# EasyEDA Pro project board-v3-rev1-schematic.epro

# Board PCB2
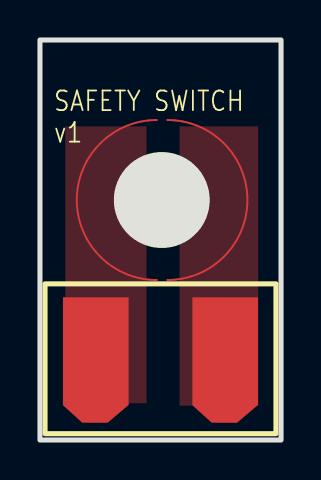
[diagram p0: board, top side]
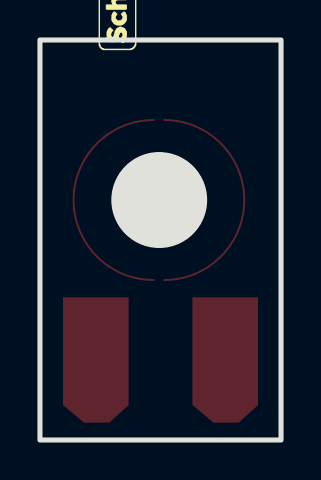
[diagram p1: board, bottom side, seen from below]

Outline 12.06 x 20 mm; copper layers: Top Layer, Bottom Layer. Coordinates in mm from the lower left corner of the outline.
Outline path: rectangle 0,20 12.06,0
Stack: Top Layer 0.035mm / Dielectric1 1.51mm FR4 er 4.5 / Bottom Layer 0.035mm

## Design rules (mm)
template: JLCPCB Capability(Two Layers Board)
spacing copperThickness1oz (default): track to track 0.102, other pairs 0.152 to 0.3
spacing copperThickness2oz: track to track 0.203, other pairs 0.152 to 0.3
track width copperThickness1oz (default): min 0.127, default 0.254, max 2.54
track width copperThickness2oz: min 0.203, default 0.254, max 2.54
differential pair differentialPair (default): width min 0.127, default 0.254, max 2.54; gap min 0.152, default 0.152
via viaSize (default): diameter min 0.5, default 0.61, max 10; hole min 0.3, default 0.305, max 6.3

## Placement (name value [footprint] x y rotation side)
U1  -  [Battery Solder Pad]  6.1 0.82 0 top
U2  -  [screw_switch]  6.1 12 0 top

## Footprints (pads in the part's own frame, mm; a bottom-side part is the same pattern mirrored in y, then rotated)
Battery Solder Pad
  custom 3.286x6.269 smd: 1(-3.302,3.175) 2(3.175,3.175)
screw_switch
  custom 4x8 smd: 1(-2.254,0) 2(2.286,0)

## Nets
$1N152: U1.1 U2.1
$1N166: U1.2 U2.2

## Copper pours and planes (outline as drawn; the poured copper is in the pictures)
$1N152 on Top Layer: 1.27,15.68 5.33,15.68 5.33,1.84 1.27,1.84
$1N166 on Top Layer: 6.99,15.68 10.92,15.68 10.92,1.71 6.99,1.71

## Text on the board
Top Silkscreen Layer: SAFETY SWITCH / v1

# Board PCB1_1
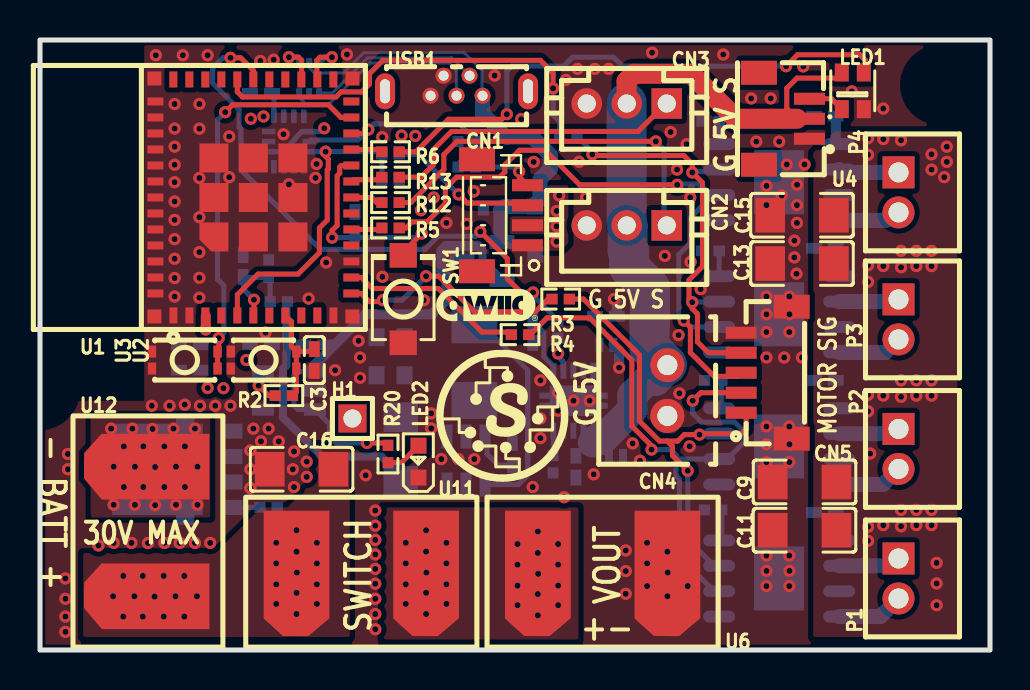
[diagram p2: board, top side]
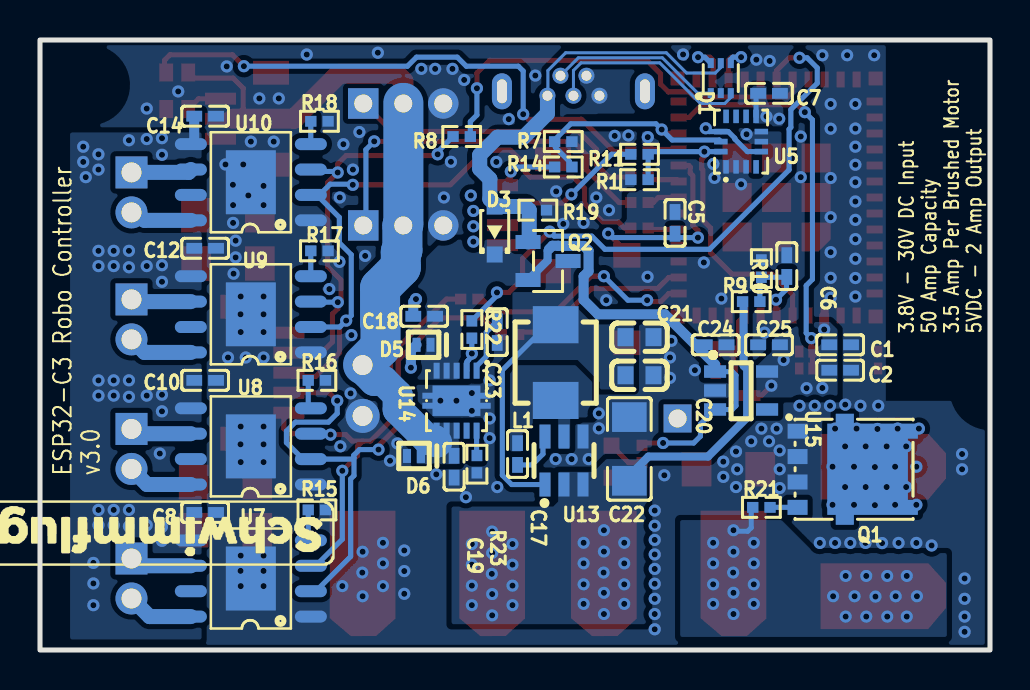
[diagram p3: board, bottom side, seen from below]

Outline 47.5 x 30.5 mm; copper layers: Top Layer, Inner1, Inner2, Bottom Layer. Coordinates in mm from the lower left corner of the outline.
Outline path: rectangle 0,30.5 47.5,0
Stack: Top Layer 0.035mm Outer layer thickness 1oz / Dielectric1 0.2104mm 7628 RC49% 8.6mil / Inner1 0.0152mm Inner layer thickness / Dielectric2 1.065mm 1.1mm H/HOZ Copper / Inner2 0.0152mm Inner layer thickness / Dielectric3 0.2104mm 7628 RC49% 8.6mil / Bottom Layer 0.035mm Outer layer thickness 1oz

## Design rules (mm)
template: Custom Config
spacing copperThickness1oz (default): track to track 0.102, other pairs 0.152 to 0.3
spacing copperThickness2oz: track to track 0.203, other pairs 0.152 to 0.3
track width copperThickness1oz (default): min 0.127, default 0.254, max 2.54
track width copperThickness2oz: min 0.203, default 0.254, max 2.54
differential pair differentialPair (default): width min 0.127, default 0.254, max 2.54; gap min 0.152, default 0.152
via viaSize (default): diameter min 0.5, default 0.61, max 10; hole min 0.3, default 0.305, max 6.3
net 3V3 uses copperRegionDirect
net GND uses copperRegionDirect
net V_IN uses copperRegionDirect
net BATT_IN uses copperRegionDirect
net BATT_GND uses copperRegionDirect
net 5V0 uses copperRegionDirect
net 5V0_FUSED uses copperRegionDirect
net 5V0_BUCK uses copperRegionDirect
net $5N11099 uses copperRegionDirect

## Placement (name value [footprint] x y rotation side)
C1  10uF  [C0402]  7.49 15.26 0 bottom
C2  100nF  [C0402]  7.49 13.99 0 bottom
C3  1uF  [C0402]  13.72 14.5 90 top
C5  1uF  [C0402]  15.75 21.36 270 bottom
C6  47nF  [C0402]  10.16 19.2 270 bottom
C7  100nF  [C0402]  11.05 27.83 0 bottom
C8  100nF  [C0402]  39.24 6.88 0 bottom
C9  10uF  [C1206]  38.23 8.4 0 top
C10  100nF  [C0402]  39.24 13.48 0 bottom
C11  10uF  [C1206]  38.23 5.99 0 top
C12  100nF  [C0402]  39.24 20.09 0 bottom
C13  10uF  [C1206]  38.1 19.32 0 top
C14  100nF  [C0402]  39.24 26.69 0 bottom
C15  10uF  [C1206]  38.1 21.74 0 top
C16  10uF  [C1206]  13.08 9.04 0 top
C17  100nF  [C0402]  23.62 9.8 270 bottom
C18  100nF  [C0402]  28.29 16.69 180 bottom
C19  1uF  [C0402]  26.8 9.16 90 bottom
C20  22uF  [C0603]  17.53 13.74 0 bottom
C21  22uF  [C0603]  17.53 15.64 0 bottom
C22  10uF  [C1206]  18.03 10.05 270 bottom
C23  1nF  [C0402]  24.64 15.89 90 bottom
C24  1uF  [C0402]  13.72 15.26 0 bottom
C25  1uF  [C0402]  11.05 15.26 180 bottom
CN1  BM04B-SRSS-TB(LF)(SN)  [CONN-SMD_BM04B-SRSS-TB]  23.11 21.74 90 top
CN2  SERVO1  [CONN-TH_3P-P2.00_BX-PH2.0-3PZZ]  29.34 21.23 180 top
CN3  SERVO2  [CONN-TH_3P-P2.00_BX-PH2.0-3PZZ]  29.34 27.33 180 top
CN4  B2B-XH-A(LF)(SN)  [CONN-TH_B2B-XH-A-LF-SN]  31.37 12.97 90 top
CN5  WAFER-SH1.0-5PLB  [CONN-SMD-5P-P1.00_BM05B-SRSS-TB-LF-SN]  36.32 13.86 90 top
D1  USBLC6-2P6_C2827693  [SOT-666-6_L1.6-W1.2-P0.50-LS1.6-BL]  13.46 28.59 180 bottom
D3  PMEG1020EA,115  [SOD-323_L1.7-W1.3-LS2.5-RD]  24.76 20.97 90 bottom
D5  RB161QS-40T18R  [X2-DFN1006-2_L1.0-W0.6-P0.65-RD]  28.32 15.26 0 bottom
D6  RB161QS-40T18R  [X2-DFN1006-2_L1.0-W0.6-P0.65-RD]  28.8 9.7 0 bottom
H1  -  [HDR-TH_1P-V-M_XKB_X4611WV-01I-C28D40]  15.62 11.58 0 top
L1  4.7uH  [IND-SMD_L4.5-W4.1_IHLP]  21.72 14.37 90 bottom
LED1  WS2812C-2020-V1  [LED-SMD_4P-L2.0-W2.0-TL_WS2812B-2020]  40.64 27.96 90 top
LED2  KT-0603R  [LED0603-RD]  18.92 9.42 90 top
P1  MOTOR1A  [CONN-TH_2P-P2.00_PH-2A_C2319]  42.93 3.58 90 top
P2  MOTOR1B  [CONN-TH_2P-P2.00_PH-2A_C2319]  42.93 10.05 90 top
P3  MOTOR2A  [CONN-TH_2P-P2.00_PH-2A_C2319]  42.93 16.53 90 top
P4  MOTOR2B  [CONN-TH_2P-P2.00_PH-2A_C2319]  42.93 22.88 90 top
Q1  NTMFS5C612NLT1G  [DFN-5_L6.1-W5.1-P1.27-BL]  7.75 9.04 270 bottom
Q2  DMG2305UX-7  [SOT-23-3_L2.9-W1.3-P1.90-LS2.4-BR]  22.1 19.45 0 bottom
R1  10kΩ  [R0402]  17.53 23.52 0 bottom
R2  10kΩ  [R0402]  12.19 12.72 180 top
R3  220Ω  [R0402]  26.03 17.55 180 top
R4  220Ω  [R0402]  24 15.77 180 top
R5  220Ω  [R0402]  17.53 21.1 180 top
R6  220Ω  [R0402]  17.53 24.91 180 top
R7  10kΩ  [R0402]  21.34 25.42 0 bottom
R8  220Ω  [R0402]  26.42 25.67 0 bottom
R9  27kΩ  [R0402]  11.94 17.42 0 bottom
R10  3kΩ  [R0402]  11.43 19.07 270 bottom
R11  100Ω  [R0402]  17.53 24.78 0 bottom
R12  220Ω  [R0402]  17.53 22.37 0 top
R13  220Ω  [R0402]  17.53 23.64 0 top
R14  100Ω  [R0402]  21.34 24.15 0 bottom
R15  18kΩ  [R0402]  33.66 7 0 bottom
R16  18kΩ  [R0402]  33.66 13.48 0 bottom
R17  18kΩ  [R0402]  33.53 19.96 0 bottom
R18  18kΩ  [R0402]  33.53 26.44 0 bottom
R19  10kΩ  [R0402]  22.61 21.99 0 bottom
R20  5.1kΩ  [R0402]  17.4 9.8 90 top
R21  10kΩ  [R0402]  11.43 7.13 0 bottom
R22  220Ω  [R0402]  25.91 16.02 270 bottom
R23  43kΩ  [R0402]  25.65 9.29 270 bottom
SW1  TS-1088-AR02016  [SW-SMD_L3.9-W3.0-P4.45]  18.16 17.55 90 top
U1  2.4GHz  [WIFIM-SMD_ESP32-C3-MINI-1]  10.67 22.63 90 top
U2  RESET  [SW-SMD_4P-L3.0-W2.0-P0.85-LS3.5]  11.18 14.5 180 top
U3  BOOT  [SW-SMD_4P-L3.0-W2.0-P0.85-LS3.5]  7.24 14.5 180 top
U4  LED  [CONN-SMD-3P-P1.00_BM03B-SRSS-TB-LF-SN]  37.21 26.56 270 top
U5  LSM6DS3TR-C  [LGA-14_L3.0-W2.5-P0.50-TL]  12.45 25.42 90 bottom
U6  -  [Battery Solder Pad]  28.19 0.66 0 top
U7  DRV8871DDAR  [SO-8_L4.9-W3.9-P1.27-LS6.0-BL-EP]  36.96 3.58 90 bottom
U8  DRV8871DDAR  [SO-8_L4.9-W3.9-P1.27-LS6.0-BL-EP]  36.96 10.18 90 bottom
U9  DRV8871DDAR  [SO-8_L4.9-W3.9-P1.27-LS6.0-BL-EP]  36.96 16.78 90 bottom
U10  DRV8871DDAR  [SO-8_L4.9-W3.9-P1.27-LS6.0-BL-EP]  36.96 23.39 90 bottom
U11  -  [Battery Solder Pad]  16.13 0.66 0 top
U12  -  [Battery Solder Pad]  2.16 5.86 270 top
U13  AP63205WU-7  [TSOT-23-6_L2.9-W1.6-P0.95-LS2.8-BL]  21.3 9.47 180 bottom
U14  TPS259241DRCR  [VSON-10_L3.0-W3.0-P0.50-TL-EP]  26.67 12.47 270 bottom
U15  AP2112K-3.3TRG1  [SOT-25-5_L2.9-W1.6-P0.95-LS2.8-BL]  12.45 12.97 270 bottom
USB1  MICRO 180°JB  [MINI-USB-SMD_U255-051N-4BH70-XS]  20.83 28.21 0 top

## Footprints (pads in the part's own frame, mm; a bottom-side part is the same pattern mirrored in y, then rotated)
Battery Solder Pad
  custom 3.286x6.269 smd: 1(-3.302,3.175) 2(3.175,3.175)
C0402
  rect 0.79x0.54 smd: 1(-0.545,0) 2(0.545,0)
C0603
  rect 0.8x0.9 smd: 1(-0.7,0) 2(0.7,0)
C1206
  rect 1.485x1.728 smd: 1(-1.593,0) 2(1.593,0)
CONN-SMD-3P-P1.00_BM03B-SRSS-TB-LF-SN
  rect 0.6x1.55 smd: 1(1,1.262) 2(0,1.262) 3(-1,1.262)
  rect 1.2x1.8 smd: 4(2.3,-1.262) 5(-2.3,-1.262)
CONN-SMD-5P-P1.00_BM05B-SRSS-TB-LF-SN
  rect 0.6x1.55 smd: 1(-2,1.262) 2(-1,1.262) 3(0,1.262) 4(1,1.262) 5(2,1.262)
  rect 1.2x1.8 smd: 6(3.3,-1.262) 7(-3.3,-1.262)
CONN-SMD_BM04B-SRSS-TB
  rect 1.2x1.8 smd: 0(-2.8,1.262) 0(2.8,1.262)
  rect 0.6x1.55 smd: 1(-1.5,-1.262) 2(-0.5,-1.262) 3(0.5,-1.262) 4(1.5,-1.262)
CONN-TH_2P-P2.00_PH-2A_C2319
  rect 1.6x1.6 hole 1: 1(1,0)
  round 1.6 hole 1: 2(-1,0)
CONN-TH_3P-P2.00_BX-PH2.0-3PZZ
  rect 1.524x1.524 hole 0.9: 1(-2,0)
  round 1.524 hole 0.9: 2(0,0) 3(2,0)
CONN-TH_B2B-XH-A-LF-SN
  round 1.7 hole 1: 1(1.27,0) 2(-1.27,0)
DFN-5_L6.1-W5.1-P1.27-BL
  rect 0.75x1 smd: 1(-1.905,-1.875) 2(-0.635,-1.875) 3(0.635,-1.875) 4(1.905,-1.875)
  custom 5.55x4.53 smd: 5(0,1.875)
HDR-TH_1P-V-M_XKB_X4611WV-01I-C28D40
  rect 1.4x1.4 hole 0.9: 1(0,0)
IND-SMD_L4.5-W4.1_IHLP
  rect 1.855x2.286 smd: 1(-1.893,0) 2(1.893,0)
LED0603-RD
  rect 0.8x0.8 smd: 1(-0.799,0) 2(0.799,0)
LED-SMD_4P-L2.0-W2.0-TL_WS2812B-2020
  rect 0.9x0.7 smd: 1(-0.915,0.55) 2(-0.915,-0.55) 3(0.915,-0.55) 4(0.915,0.55)
LGA-14_L3.0-W2.5-P0.50-TL
  rect 0.675x0.28 smd: 1(-1.262,0.75) 2(-1.262,0.25) 3(-1.262,-0.25) 4(-1.262,-0.75) 8(1.262,-0.75) 9(1.262,-0.25) 10(1.262,0.25) 11(1.262,0.75)
  rect 0.28x0.675 smd: 5(-0.5,-1.012) 6(0,-1.012) 7(0.5,-1.012) 12(0.5,1.012) 13(0,1.012) 14(-0.5,1.012)
MINI-USB-SMD_U255-051N-4BH70-XS
  round 0.8 hole 0.5: 1(1.3,-0.5) 2(0.65,0.5) 3(0,-0.5) 4(-0.65,0.5) 5(-1.3,-0.5)
  oval 1x1.8 hole 0.5x1.2: 6(-3.575,-0.28) 6(3.575,-0.28)
R0402
  rect 0.566x0.54 smd: 1(-0.433,0) 2(0.433,0)
SO-8_L4.9-W3.9-P1.27-LS6.0-BL-EP
  oval 0.6x1.6 smd: 1(-1.905,-3) 2(-0.635,-3) 3(0.635,-3) 4(1.905,-3) 5(1.905,3) 6(0.635,3) 7(-0.635,3) 8(-1.905,3)
  rect 3.2x2.5 smd: 9(0,0)
SOD-323_L1.7-W1.3-LS2.5-RD
  rect 0.8x0.8 smd: 1(-1.2,0) 2(1.2,0)
SOT-23-3_L2.9-W1.3-P1.90-LS2.4-BR
  rect 1.25x0.7 smd: 1(1,-0.95) 2(1,0.95) 3(-1,0)
SOT-25-5_L2.9-W1.6-P0.95-LS2.8-BL
  rect 0.623x1.105 smd: 1(-0.95,-1.3) 2(-0.001,-1.3) 3(0.95,-1.3) 4(0.95,1.3) 5(-0.95,1.3)
SOT-666-6_L1.6-W1.2-P0.50-LS1.6-BL
  rect 0.3x0.5 smd: 1(-0.5,-0.75) 2(-0.001,-0.75) 3(0.5,-0.75) 4(0.5,0.75) 5(0,0.75) 6(-0.5,0.75)
SW-SMD_4P-L3.0-W2.0-P0.85-LS3.5
  rect 0.42x0.6 smd: 1(-1.64,0.425) 1(-1.64,-0.425) 2(1.64,0.425) 2(1.64,-0.425)
SW-SMD_L3.9-W3.0-P4.45
  rect 1.23x1.36 smd: 1(-2.185,0) 2(2.185,0)
TSOT-23-6_L2.9-W1.6-P0.95-LS2.8-BL
  rect 0.55x1.2 smd: 1(-0.95,-1.2) 2(0,-1.2) 3(0.95,-1.2) 4(0.95,1.2) 5(0,1.2) 6(-0.95,1.2)
VSON-10_L3.0-W3.0-P0.50-TL-EP
  rect 0.8x0.3 smd: 1(-1.5,1) 2(-1.5,0.5) 3(-1.5,0) 4(-1.5,-0.5) 5(-1.5,-1) 6(1.5,-1) 7(1.5,-0.5) 8(1.5,0) 9(1.5,0.5) 10(1.5,1)
  custom 1.52x3.42 smd: 11(0.002,-0.009)
WIFIM-SMD_ESP32-C3-MINI-1
  rect 0.8x0.4 smd: 1(-5.9,4) 2(-5.9,3.2) 3(-5.9,2.4) 4(-5.9,1.6) 5(-5.9,0.8) 6(-5.9,0) 7(-5.9,-0.8) 8(-5.9,-1.6) 9(-5.9,-2.4) 10(-5.9,-3.2) 11(-5.9,-4) 25(5.9,-4) 26(5.9,-3.2) 27(5.9,-2.4) 28(5.9,-1.6) 29(5.9,-0.8) 30(5.9,0) 31(5.9,0.8) 32(5.9,1.6) 33(5.9,2.4) 34(5.9,3.2) 35(5.9,4)
  rect 0.4x0.8 smd: 12(-4.8,-4.9) 13(-4,-4.9) 14(-3.2,-4.9) 15(-2.4,-4.9) 16(-1.6,-4.9) 17(-0.8,-4.9) 18(0,-4.9) 19(0.8,-4.9) 20(1.6,-4.9) 21(2.4,-4.9) 22(3.2,-4.9) 23(4,-4.9) 24(4.8,-4.9) 36(4.8,4.9) 37(4,4.9) 38(3.2,4.9) 39(2.4,4.9) 40(1.6,4.9) 41(0.8,4.9) 42(0,4.9) 43(-0.8,4.9) 44(-1.6,4.9) 45(-2.4,4.9) 46(-3.2,4.9) 47(-4,4.9) 48(-4.8,4.9)
  custom 1.45x1.45 smd: 49(-1.975,1.975)
  rect 1.45x1.45 smd: 49(-1.975,0) 49(-1.975,-1.975) 49(0,1.975) 49(0,0) 49(0,-1.975) 49(1.975,1.975) 49(1.975,0) 49(1.975,-1.975)
  rect 0.7x0.7 smd: 50(5.95,4.95) 51(5.95,-4.95) 52(-5.95,-4.95) 53(-5.95,4.95)
X2-DFN1006-2_L1.0-W0.6-P0.65-RD
  rect 0.4x0.7 smd: 1(-0.35,0) 2(0.35,0)

## Nets
3V3: C1.2 C2.2 C7.2 C25.2 CN1.2 R1.2 R2.2 R7.1 U1.3 U5.5 U5.8 U5.12 U15.5
5V0: C18.2 C24.2 D3.1 D5.1 Q2.2 R20.2 U14.3 U14.4 U14.5 U15.1 U15.3
5V0_BUCK: C20.2 C21.2 L1.2 Q2.3 U13.1
5V0_FUSED: C19.2 CN2.2 CN3.2 CN4.1 D6.1 LED1.4 U4.2 U14.6 U14.7 U14.8
5V_EXT_EN: R22.1 U1.30
GND: C1.1 C2.1 C3.1 C5.1 C6.1 C7.1 C8.1 C9.1 C10.1 C11.1 C12.1 C13.1 C14.1 C15.1 C16.1 C18.1 C19.1 C20.1 C21.1 C22.1 C23.1 C24.1 C25.1 CN1.1 CN2.3 CN3.3 CN4.2 CN5.5 CN5.6 CN5.7 D1.2 D5.2 D6.2 LED1.2 LED2.1 Q1.1 Q1.2 Q1.3 R10.1 R15.1 R16.1 R17.1 R18.1 R19.1 R23.2 SW1.1 U1.1 U1.2 U1.11 U1.14 U1.36 U1.37 U1.38 U1.39 U1.40 U1.41 U1.42 U1.43 U1.44 U1.45 U1.46 U1.47 U1.48 U1.49 U1.50 U1.51 U1.52 U1.53 U2.2 U3.2 U4.1 U5.1 U5.2 U5.3 U5.6 U5.7 U6.2 U7.1 U7.7 U7.9 U8.1 U8.7 U8.9 U9.1 U9.7 U9.9 U10.1 U10.7 U10.9 U13.4 U14.11 U15.2 USB1.4 USB1.5
BATT_GND: Q1.5 U12.1
BATT_IN: C16.2 R21.2 U11.1 U12.2
BATT_MEAS: C6.2 R9.1 R10.2 U1.6
BOOT: U1.23 U3.1
DEBUG_LED: LED1.3 R6.1
DN: D1.6 U1.26
DN_IN: D1.1 USB1.2
DP: D1.4 U1.27
DP_IN: D1.3 USB1.3
LED_OUT: LED1.1 U4.3
MODE_BUTTON: C5.2 SW1.2 U1.20
MOTOR1_IN1: CN5.1 R3.1 U7.3 U8.3
MOTOR1_IN2: CN5.2 R4.1 U7.2 U8.2
MOTOR1_OUT1A: P1.1 U7.6
MOTOR1_OUT1B: P2.1 U8.6
MOTOR1_OUT2A: P1.2 U7.8
MOTOR1_OUT2B: P2.2 U8.8
MOTOR2_IN1: CN5.4 R8.2 U9.3 U10.3
MOTOR2_IN2: CN5.3 R5.1 U9.2 U10.2
MOTOR2_OUT1A: P3.1 U9.6
MOTOR2_OUT1B: P4.1 U10.6
MOTOR2_OUT2A: P3.2 U9.8
MOTOR2_OUT2B: P4.2 U10.8
RESET: C3.2 R2.1 U1.8 U2.1
SCL: R7.2 R14.1 U1.22 U5.13
SDA: R1.1 R11.1 U1.5 U5.14
SERVO1: R12.1 U1.18
SERVO2: R13.1 U1.19
USB_VIN: D1.5 D3.2 Q2.1 R19.2 USB1.1
V_IN: C8.2 C9.2 C10.2 C11.2 C12.2 C13.2 C14.2 C15.2 C22.2 R9.2 U6.1 U7.5 U8.5 U9.5 U10.5 U11.2 U13.2 U13.3
$2N10285: R6.2 U1.21
$2N12085: R8.1 U1.31
$2N12127: R5.2 U1.16
$2N12172: R3.2 U1.12
$2N12214: R4.2 U1.13
$3N20109: CN1.4 R14.2
$3N20191: CN1.3 R11.2
$3N23967: CN2.1 R12.2
$3N23969: CN3.1 R13.2
$5N508: Q1.4 R21.1
$5N7787: H1.1 R22.2 U14.2
$5N7998: R23.1 U14.10
$5N8090: C23.2 U14.1
$5N11099: C17.1 L1.1 U13.5
$5N11102: C17.2 U13.6
$5N13004: LED2.2 R20.1
$7N723: R15.2 U7.4
$7N734: R17.2 U9.4
$7N1444: R18.2 U10.4
$7N1464: R16.2 U8.4

Pads without a net: CN1 0; U1 4 7 9 10 15 17 24 25 28 29 32 33 34 35; U4 4 5; U5 4 9 10 11; U14 9; U15 4; USB1 6

## Via types
v1: diameter 0.61, hole 0.305, Top Layer to Bottom Layer, 336 vias

## Routing (per net, layer and track width the routed paths; a pad name or vN(x,y) marks a point on that pad's centre or on a via; arc(x,y) is an arc through that point)
3V3: length 6.2
  Top Layer w0.254: R2.2 11.43,12.72 v1(10.93,13.22)
  Top Layer w0.5: v1(8.29,16.03) 8.29,16.7
  Bottom Layer w0.254: U5.8 11.7,27.73 C7.2 ; v1(14.21,26.08) 14.05,25.92 U5.12 13.09,25.92 12.76,25.59 12.76,25.55 12.13,24.92 U5.5
  vias: v1(8.38,13.1) v1(9.17,13.09) v1(10.32,14.5) v1(10.54,26.56) v1(11.18,26.68) v1(18.08,25.72) v1(18.76,25.71) v1(19.05,21.99) v1(19.69,22.63) v1(25.83,21.95) v1(25.83,21.19) v1(25.83,20.42) v1(25.96,22.73)
5V0: length 23.5
  Top Layer w0.254: v1(16.35,10.35) 17.28,10.35 R20.2
  Bottom Layer w0.254: U15.1 13.74,13.92 12.88,13.92 12.7,13.74 12.7,12.21 12.89,12.02 U15.3 14.48,11.29 14.48,10.69 14.81,10.35 v1(16.35,10.35)
  Bottom Layer w0.4: Q2.2 22.12,19.48 22.12,19.97 22.05,20.04
  Bottom Layer w0.5: U15.1 13.75,14.27 16.26,16.78 19.6,16.78 20.32,17.51 20.32,18.69 20.07,18.93 20.07,19.97 20.31,20.2 21.58,20.2 21.59,20.21 21.88,20.21 22.05,20.04
5V0_BUCK: length 11.2
  Bottom Layer w0.254: L1.2 22.21,15.77 22.61,15.77 24.38,13.99 24.38,8.74 23.92,8.27 U13.1
5V0_FUSED: length 35.8
  Top Layer w0.254: U4.2 37.85,26.56 37.34,27.07 37.34,28.09 37.85,28.59 39.81,28.59 LED1.4
  Top Layer w1: 29.33,27.36 29.33,28.44 29.7,28.81 32.55,28.81 34.8,26.56 37.85,26.56
  Bottom Layer w1.5: 27.64,10.37 27.77,10.5 28.09,10.5 29.62,12.02 29.62,12.75 30.33,13.46 30.8,13.46 31.37,14.03 CN4.1
  Bottom Layer w2: 31.35,14.27 30.47,15.14 30.47,16.35 30.5,16.37 30.5,18.1 29.46,19.14 29.46,19.91 29.38,19.98 29.38,21.21 29.33,21.26 ; 29.33,27.36 29.33,21.39
5V_EXT_EN: length 29
  Top Layer w0.254: v1(24.65,17.88) 24.05,17.88 23.37,18.56 23.37,19.57 v1(22.02,20.92) ; v1(9.53,29.61) 10.03,29.61 10.67,28.98 U1.30
  Bottom Layer w0.254: v1(9.53,29.61) 9.14,29.61 8.64,29.1 8.64,28.34 9.96,27.02 9.96,26.13 10.05,26.04 10.05,24.01 14.02,20.03 19.25,20.03 19.91,20.69 21.79,20.69 v1(22.02,20.92) ; R22.1 25.91,16.47 24.65,17.72 v1(24.65,17.88)
GND: length 2.2
  Bottom Layer w0.5: D5.2 28.96,14.97 v1(28.96,14.12) ; C18.1 28.84,17.41 v1(28.7,17.55)
  vias: v1(1.27,3.58) v1(1.27,2.56) v1(1.27,1.67) v1(1.27,0.91) v1(1.4,9.8) v1(1.4,9.04) v1(2.92,5.23) v1(3.68,5.35) v1(4.57,5.35) v1(5.4,5.35) v1(5.59,12.21) v1(5.79,29.74) v1(6.22,5.35) v1(6.48,12.21) v1(6.73,27.3) v1(6.73,26.07) v1(6.73,25.17) v1(6.73,24.26) v1(6.73,23.39) v1(6.73,22.43) v1(6.73,21.51) v1(6.73,20.54) v1(6.73,19.56) v1(6.73,18.6) v1(6.73,17.67) v1(6.98,5.35) v1(7.14,29.74) v1(7.24,12.27) v1(7.75,5.35) v1(7.97,27.3) v1(7.97,26.07) v1(7.97,23.6) v1(7.97,21.64) v1(7.97,19.89) v1(7.97,18.61) v1(7.97,17.61) v1(8,12.21) v1(8.38,29.74) v1(8.51,5.35) v1(8.76,12.21) v1(9.46,25.67) v1(9.46,23.64) v1(9.53,12.21) v1(10.52,9.98) v1(10.52,9.04) v1(10.52,8.1) v1(10.67,11.07) v1(11.02,29.45) v1(11.05,10.43) v1(11.28,15.87) v1(11.43,11.07) v1(11.68,29.52) v1(11.94,10.43) v1(12.17,25.79) v1(12.45,23.29) v1(12.64,9.04) v1(12.7,9.93) v1(12.7,8.15) v1(13.34,9.42) v1(13.34,8.66) v1(13.43,17.57) v1(13.83,24.3) v1(13.78,23.61) v1(14.31,19.38) v1(14.76,13.99) v1(15.35,29.78) v1(15.93,15.46) v1(16,14.62) v1(16,13.61) v1(16.28,8.74) v1(16.76,6.97) v1(16.76,6.21) v1(16.76,5.5) v1(16.76,4.78) v1(16.76,4.05) v1(16.76,3.31) v1(16.76,2.56) v1(16.76,1.8) v1(16.76,1.04) v1(17.11,25.64) v1(17.12,18.66) v1(19.19,17.49) v1(19.56,11.83) v1(19.56,11.08) v1(20.07,9.55) v1(20.32,21.36) v1(20.92,9.55) v1(21.34,21.31) v1(21.69,22.93) v1(21.72,9.55) v1(22.73,28.72) v1(24.06,26.54) v1(24.64,8.15) v1(24.68,24.4) v1(25.02,13.48) v1(25.02,11.58) v1(25.02,10.59) v1(25.91,12.85) v1(25.91,11.96) v1(26.21,7.64) v1(26.29,28.5) v1(26.68,12.46) v1(26.88,29.06) v1(26.95,24.41) v1(27.31,22.63) v1(27.48,12.47) v1(27.74,29.06) v1(27.69,8.78) v1(28.43,29.06) v1(29.29,4.98) v1(29.29,3.95) v1(29.29,2.81) v1(29.63,10.33) v1(30,9.46) v1(30.35,5.36) v1(30.35,4.33) v1(30.35,3.19) v1(30.61,29.86) v1(31.24,19.7) v1(31.37,4.92) v1(31.39,3.87) v1(31.37,2.69) v1(31.53,25.9) v1(31.85,24.02) v1(31.93,15.74) v1(31.97,12.83) v1(32.33,25.29) v1(32.38,3.19) v1(32.51,22.63) v1(32.53,19.41) v1(32.48,10.18) v1(33.03,18.05) v1(34.16,29.77) v1(35.56,27.58) v1(35.81,25.42) v1(36.32,23.21) v1(36.32,22.25) v1(36.32,17.67) v1(36.32,16.78) v1(36.32,15.9) v1(36.32,14.62) v1(36.32,11.17) v1(36.32,10.28) v1(36.32,9.39) v1(36.32,4.72) v1(36.32,3.95) v1(36.32,3.19) v1(36.53,27.58) v1(36.96,25.42) v1(37.08,22.73) v1(37.21,14.62) v1(37.34,24.28) v1(37.47,17.67) v1(37.47,16.79) v1(37.47,15.9) v1(37.47,11.17) v1(37.47,10.28) v1(37.47,9.39) v1(37.47,4.72) v1(37.47,3.96) v1(37.47,3.19) v1(37.72,20.47) v1(37.72,19.63) v1(37.85,22.25) v1(37.85,21.36) v1(37.82,18.82) v1(37.85,23.26) v1(38.1,14.62) v1(38.16,29.18) v1(38.23,24.28) v1(40.59,27.93) v1(42.16,27.07)
BATT_GND:
  vias: v1(3.56,11.07) v1(3.68,9.16) v1(3.68,7.26) v1(4.19,10.18) v1(4.19,8.15) v1(4.62,11.07) v1(4.75,9.16) v1(4.75,7.26) v1(5.17,10.18) v1(5.17,8.15) v1(5.63,11.05) v1(5.76,9.15) v1(5.76,7.24) v1(6.22,10.18) v1(6.22,8.15) v1(6.67,11.07) v1(6.8,9.16) v1(6.8,7.26) v1(7.25,10.18) v1(7.25,8.15) v1(7.75,11.07) v1(7.87,9.16) v1(7.87,7.26)
BATT_IN: length 2
  Bottom Layer w0.254: v1(12.83,5.99) 12.77,5.94 12.12,5.94 11.94,6.12 11.94,7.06 R21.2
  vias: v1(3.65,2.69) v1(4.16,3.7) v1(4.16,1.67) v1(4.72,2.69) v1(5.14,3.7) v1(5.14,1.67) v1(5.73,2.67) v1(6.19,3.7) v1(6.19,1.67) v1(6.77,2.69) v1(7.22,3.7) v1(7.22,1.67) v1(7.84,2.69) v1(11.81,5.36) v1(11.81,4.33) v1(11.81,3.28) v1(11.81,2.31) v1(12.83,4.92) v1(12.84,3.87) v1(12.83,2.86) v1(12.83,1.8) v1(13.84,5.36) v1(13.84,4.33) v1(13.84,3.28) v1(13.84,2.31)
BATT_MEAS: length 4.7
  Top Layer w0.254: v1(10.7,17.51) 10.7,16.76 U1.6
  Bottom Layer w0.254: 10.17,18.64 10.17,18.04 v1(10.7,17.51) ; 10.17,18.64 R10.2 11.5,18.56 R9.1 ; 10.17,18.64 C6.2
BOOT: length 20
  Top Layer w0.254: 8.88,14.07 U3.1 8.94,14.98 v1(8.94,15.59) ; v1(9.26,26.89) 9.63,27.26 14.41,27.26 15.05,26.63 U1.23
  Bottom Layer w0.254: v1(8.94,15.59) 9.19,15.85 9.19,18.22 8.88,18.53 8.88,26.51 v1(9.26,26.89)
DEBUG_LED: length 27.7
  Top Layer w0.254: v1(37.31,29.19) 37.88,29.76 41,29.76 41.28,29.48 41.28,28.96 LED1.3 ; v1(23.34,26.79) 23.09,26.54 20.42,26.54 18.8,24.91 R6.1
  Bottom Layer w0.254: v1(23.34,26.79) 23.34,28.95 23.58,29.19 26.18,29.19 26.64,29.64 28.67,29.64 29.13,29.19 v1(37.31,29.19)
DN: length 2.5
  Top Layer w0.254: v1(14.6,29.64) 14,29.64 13.84,29.48 13.84,28.55 U1.26
  Bottom Layer w0.254: D1.6 14.26,29.64 v1(14.6,29.64)
DN_IN: length 8.6
  Bottom Layer w0.15: D1.1 14.62,27.84 16.38,29.61 20.58,29.61 USB1.2
DP: length 2.4
  Top Layer w0.254: v1(12.45,29.64) 12.92,29.64 13.08,29.48 13.08,28.54 U1.27
  Bottom Layer w0.254: D1.4 12.96,29.53 12.85,29.64 v1(12.45,29.64)
DP_IN: length 10.5
  Bottom Layer w0.15: USB1.3 20.83,28.98 20.45,29.36 16.51,29.36 14.48,27.33 13.26,27.33 12.94,27.64 12.94,27.83 D1.3
LED_OUT: length 1.8
  Top Layer w0.254: U4.3 39.57,27.56 LED1.1
MODE_BUTTON: length 10.1
  Top Layer w0.254: U1.20 15.06,24.23 14.99,24.15 14.99,23.84 14.86,23.71 14.86,21.23 14.6,20.97 v1(14.6,20.62) ; v1(19.09,20.82) 18.25,19.98 18.16,19.98
  Bottom Layer w0.254: v1(19.09,20.82) 18.89,20.62 v1(14.6,20.62)
MOTOR1_IN1: length 23.5
  Top Layer w0.254: 31.35,10.45 31.62,10.18 31.62,9.72 v1(32.38,8.96) ; 31.35,10.45 30.97,10.45 29.97,11.45 29.97,14.75 27.18,17.55 26.34,17.55 ; 31.35,10.45 31.89,10.45 32.21,10.77 v1(32.97,10.77) 33.02,10.81 35.05,10.81 35.31,11.07 35.31,11.62 CN5.1
  Bottom Layer w0.254: v1(32.38,8.96) 32.38,5.54 33.71,4.21 U7.3 ; v1(32.97,10.77) 33.91,10.77 U8.3
MOTOR1_IN2: length 30.8
  Top Layer w0.254: CN5.2 33.04,12.86 v1(32.64,12.47) ; 24.44,15.89 24.64,15.89 25.35,16.61 27.48,16.61 29.59,14.5 29.59,11.2 30.58,10.21 v1(30.58,10.02)
  Bottom Layer w0.254: 31.81,9.61 31.81,9.74 31.53,10.02 v1(30.58,10.02) ; 31.81,9.61 31.88,9.55 U8.2 34.35,9.55 35.18,10.37 35.18,10.94 34.73,11.39 33.08,11.39 32.64,11.83 v1(32.64,12.47) ; 31.81,9.61 31.8,9.6 31.8,8.72 31.97,8.55 31.97,4.67 33.7,2.94 U7.2
MOTOR1_OUT1A: length 3.1
  Bottom Layer w0.75: P1.1 42.56,4.21 U7.6
MOTOR1_OUT1B: length 3.1
  Bottom Layer w0.75: U8.6 42.69,10.81 P2.1
MOTOR1_OUT2A: length 3.3
  Bottom Layer w0.75: P1.2 42.02,1.67 39.96,1.67
MOTOR1_OUT2B: length 3.3
  Bottom Layer w0.75: P2.2 42.15,8.28 U8.8
MOTOR2_IN1: length 21.1
  Top Layer w0.254: v1(27.62,24.78) 27.68,24.72 32.19,24.72 32.62,24.3 v1(32.62,23.88) 33.12,23.37 33.12,19.17 32.45,18.5 32.45,17.55 v1(32.61,17.39) 32.61,17.07 32.88,16.8 32.88,15.4 33.42,14.86 CN5.4
  Bottom Layer w0.254: U9.3 33.93,17.39 v1(32.61,17.39) ; v1(32.62,23.88) 32.67,23.93 33.86,23.93 U10.3 ; R8.2 27.62,24.91 v1(27.62,24.78)
MOTOR2_IN2: length 32.6
  Top Layer w0.254: v1(32.19,16.47) 32.52,16.14 32.52,14.87 33.71,13.68 34.88,13.68 CN5.3 ; R5.1 18.29,21.1 18.59,21.41 19.35,21.41 20.27,22.32 20.27,23.08 20.83,23.64 22.99,23.64 23.24,23.9 23.24,24.25 23.97,24.99 25.25,24.99 26.98,23.26 v1(31.86,23.26)
  Bottom Layer w0.254: v1(31.86,23.26) 31.89,23.29 32.99,23.29 33.59,22.69 32.53,21.63 32.53,20.36 31.94,19.77 31.94,16.72 v1(32.19,16.47) 32.51,16.15 U9.2
MOTOR2_OUT1A: length 3
  Bottom Layer w0.75: U9.6 42.81,17.42 P3.1
MOTOR2_OUT1B: length 3
  Bottom Layer w0.75: U10.6 39.96,23.99 40.07,23.88 P4.1
MOTOR2_OUT2A: length 3.2
  Bottom Layer w0.75: P3.2 42.28,14.88 U9.8
MOTOR2_OUT2B: length 3.1
  Bottom Layer w0.75: U10.8 42.28,21.48 42.67,21.88 P4.2
RESET: length 5.3
  Top Layer w0.254: R2.1 12.82,12.91 U2.1 ; U2.1 12.57,15.17 12.57,16.42 U1.8 ; U2.1 13.6,14.92 C3.2
SCL: length 11.7
  Top Layer w0.254: U1.22 16.22,25.83 v1(16.42,26.02)
  Bottom Layer w0.254: R14.1 21.03,24.28 21.03,24.43 21.73,25.13 21.73,25.39 R7.2 21.81,25.46 20.96,26.31 16.7,26.31 v1(16.42,26.02) 15.89,25.5 13.54,25.5 U5.13
SDA: length 16.3
  Top Layer w0.254: v1(14.28,24.92) 14.28,24.68 14.42,24.54 14.42,24.06 14.36,24 14.36,21.49 13.97,21.1 13.97,19.86 12.9,18.8 10.9,18.8 9.87,17.76 U1.5
  Bottom Layer w0.254: 13.46,24.92 16.96,24.92 17.09,24.78 17.09,23.52
SERVO1: length 1.6
  Top Layer w0.254: U1.18 16.59,22.63 16.84,22.37 17.09,22.37
SERVO2: length 1.6
  Top Layer w0.254: 17.09,23.52 15.66,23.52 U1.19
USB_VIN: length 22.4
  Bottom Layer w0.15: D1.5 13.46,29.12 13.74,28.85 15.17,28.85 16.19,29.86 21.22,29.86 22.1,28.97 22.1,27.74
  Bottom Layer w0.75: Q2.1 23.04,20.46 R19.2 23.22,22.17 D3.2 24.76,22.3 25.01,22.54 25.01,23.55 25.51,24.06 25.51,24.75 24.62,25.64 23.31,25.64 22.13,26.83 USB1.1
V_IN: length 14.7
  Bottom Layer w0.4: C22.2 17.91,8.59 17.91,8.84 17.08,9.67 14.1,9.67 12.14,11.62 12.14,14.04 12.32,14.22 12.32,14.82 12.34,14.84 12.34,15.68 12.32,15.7 12.32,17.37 12.37,17.42
  Bottom Layer w0.5: U10.5 39.79,25.46 C14.2
  vias: v1(18.29,5.36) v1(18.29,4.33) v1(18.29,3.28) v1(18.29,2.31) v1(19.3,5.99) v1(19.3,4.92) v1(19.32,3.87) v1(19.3,2.86) v1(19.3,1.8) v1(20.32,5.36) v1(20.32,4.33) v1(20.32,3.28) v1(20.32,2.31) v1(23.88,5.3) v1(23.88,4.27) v1(23.88,3.22) v1(23.88,2.24) v1(24.89,5.93) v1(24.89,4.85) v1(24.91,3.81) v1(24.89,2.8) v1(24.89,1.73) v1(25.91,5.3) v1(25.91,4.27) v1(25.91,3.22) v1(25.91,2.24) v1(41.4,25.59) v1(41.4,24.76) v1(41.4,19.24) v1(41.4,18.41) v1(41.4,12.76) v1(41.4,11.93) v1(41.4,6.16) v1(41.4,5.46) v1(41.51,9.82) v1(42.16,25.55) v1(42.16,19.2) v1(42.16,12.72) v1(42.16,6.24) v1(43.05,25.49) v1(43.05,19.96) v1(43.05,19.14) v1(43.05,13.48) v1(43.05,12.66) v1(43.05,7) v1(43.05,6.18) v1(43.81,19.96) v1(43.81,19.2) v1(43.81,13.48) v1(43.81,12.72) v1(43.81,7) v1(43.81,6.24) v1(44.58,24.78) v1(44.58,24.02) v1(44.58,19.96) v1(44.58,19.19) v1(44.58,13.48) v1(44.58,12.72) v1(44.58,7) v1(44.58,6.24) v1(44.83,4.35) v1(44.83,3.33) v1(44.83,2.24) v1(45.21,23.64) v1(45.34,25.16) v1(45.34,24.4)
$2N10285: length 1.6
  Top Layer w0.254: U1.21 16.98,25.03 17.09,24.91
$2N12085: length 21.1
  Top Layer w0.254: U1.31 9.87,27.91 10.12,27.65 14.8,27.65 15.05,27.91 16.08,27.91 16.47,28.3 16.47,28.81 17.15,29.48 25.02,29.48 25.65,28.85 v1(25.65,28.09)
  Bottom Layer w0.254: v1(25.65,28.09) 25.65,26.75 25.98,26.42 R8.1
$2N12127: length 1.6
  Top Layer w0.254: U1.16 17.02,21.03 17.09,21.1
$2N12172: length 11.6
  Top Layer w0.254: 25.47,17.55 25.4,17.55 24.76,16.91 21.72,16.91 19.94,18.69 v1(19.3,18.69) ; U1.12 16.06,17.83 16.47,17.42 17.07,17.42 v1(17.15,17.49)
  Bottom Layer w0.254: v1(17.15,17.49) 18.11,17.49 v1(19.3,18.69)
$2N12214: length 9.1
  Top Layer w0.254: 23.57,15.89 22.1,15.89 19.92,18.08 16.62,18.08 16.06,18.63 U1.13
$3N20109: length 3.1
  Top Layer w0.254: v1(23.96,23.92) 23.96,23.66 CN1.4
  Bottom Layer w0.254: v1(23.96,23.92) 23.73,24.15 R14.2
$3N20191: length 7.5
  Top Layer w0.254: CN1.3 24.27,22.35 21.36,22.35 v1(20.93,22.78)
  Bottom Layer w0.254: R11.2 18.92,24.78 v1(20.93,22.78)
$3N23967: length 19
  Top Layer w0.254: R12.2 18.54,22.37 20.19,24.02 20.19,24.77 20.85,25.43 v1(30.79,25.43)
  Bottom Layer w0.254: v1(30.79,25.43) 31.21,25.02 31.21,21.9 31.46,21.64 31.46,21.26
$3N23969: length 15.4
  Top Layer w0.254: 31.33,27.36 29.9,25.93 20.57,25.93 19.67,25.02 19.67,24.26 19.05,23.64 R13.2
$5N508: length 1.4
  Bottom Layer w0.254: Q1.4 R21.1
$5N7787: length 13.4
  Inner2 w0.254: v1(25.91,14.82) 18.87,14.82 H1.1
  Bottom Layer w0.254: R22.2 v1(25.91,14.82) 25.94,14.8 25.94,14.64 26.1,14.48 26.1,14.47 26.16,14.4 26.16,13.97 U14.2
$5N7998: length 1.3
  Bottom Layer w0.254: U14.10 25.67,9.87 25.53,9.72
$5N8090: length 2.9
  Bottom Layer w0.254: C23.2 25.19,15.89 25.19,14.67 25.67,14.19 U14.1
$5N11102: length 2.4
  Bottom Layer w0.254: U13.6 22.35,10.57 22.35,9.8 22.9,9.25 C17.2
$5N13004: length 1.6
  Top Layer w0.254: 18.92,10.22 18.07,9.37 17.65,9.37
$7N723: length 1.6
  Bottom Layer w0.254: U7.4 34.09,5.61 R15.2
$7N734: length 1.3
  Bottom Layer w0.254: R17.2 33.96,18.69 U9.4
$7N1444: length 1.1
  Bottom Layer w0.254: U10.4 33.96,25.3 R18.2
$7N1464: length 1.5
  Bottom Layer w0.254: 33.96,12.08 34.09,12.22 R16.2

## Copper pours and planes (outline as drawn; the poured copper is in the pictures)
3V3 on Top Layer: 26.42,23.24 26.42,20.34 26.04,19.96 25.25,19.96 25.25,20.57 25.27,20.59 23.62,20.59 23.5,20.72 23.5,21.74 25.15,21.74 25.27,21.86 25.27,23.1 25.41,23.24
3V3 on Bottom Layer: 21.12,25 19.59,26.54 21.12,26.54
3V3 on Bottom Layer: 10.99,14.88 10.92,14.88 10.92,15.55 9.27,16.4 8,16.4 7.62,16.02 7.62,12.63 11.69,12.63 11.69,14.18
3V3 on Bottom Layer: 17.75,24.14 19.06,24.14 20.07,23.13 20.07,22.12 19.42,21.47 18.55,21.47 18.41,21.61 18.41,22.87 18.14,23.14 17.75,23.14
3V3 on Bottom Layer: 17.72,26.26 20.92,26.26 20.96,26.31 21.36,25.91 21.36,24.83 21.4,24.79 18.14,24.79 17.78,25.16 17.78,25.42 17.65,25.55 17.65,26.2
3V3 on Bottom Layer: 10.29,26.18 11.94,26.18 11.94,28.09 11.82,28.2 11.15,28.2 11.08,28.13 11.08,27.26 10.48,27.26 10.29,27.07
3V3 on Inner2: 7.8,12.49 11.01,12.49 11.83,13.48 11.83,19.22 12.59,19.97 26.18,19.97 26.54,20.34 26.54,27.07 9.91,27.07 7.62,24.13 7.62,12.68
5V0 on Bottom Layer: 28.19,13.74 28.19,15.64 27.01,14.46 26.68,14.46 26.54,14.32 26.54,13.57 28.02,13.57
5V0 on Bottom Layer: 26.13,13.51 29.08,13.51 29.08,18.74 27.3,20.52 24.14,20.52 22.73,19.11 22.73,18.21 24.35,18.21 26.13,16.43
5V0_BUCK on Bottom Layer: 17.81,16.35 17.81,13.03 19.52,13.03 19.52,13.4 20.62,14.5 23.88,14.5 23.88,17.97 22.41,17.97 22.41,19.84 20.45,19.84 20.45,17.04 19.76,16.35
5V0_FUSED on Bottom Layer: 28.67,9.29 26.55,9.29 26.55,11.37 27.89,11.37 28.7,10.55 28.7,9.32
GND on Top Layer: -4.7,34.82 49.78,34.82 49.78,-2.01 -4.7,-2.01
GND on Bottom Layer: -4.95,33.93 52.2,33.93 52.2,-2.39 -4.95,-2.39
GND on Inner1: 26.9,8.4 32.75,8.4 34.29,5.16 38.23,5.16 38.23,2.81 26.9,2.81
GND on Inner1: 29.7,8.4 32.75,8.4 34.29,5.16 38.23,5.16 38.23,2.81 33.67,2.81 33.02,3.19 29.7,3.19
GND on Inner1: -3.94,35.58 50.16,35.58 50.16,-2.9 -3.94,-2.9
GND on Inner2: -3.94,36.22 51.69,36.22 51.69,-2.9 -3.94,-2.9
BATT_GND on Top Layer: 2.54,11.7 8.51,11.7 8.51,6.62 2.54,6.62
BATT_IN on Top Layer: 8.77,4.85 2.16,4.85 2.16,0.66 15.49,0.66 15.49,10.24 13.72,10.24 13.72,8.52 12.37,7.13 11.06,7.13
BATT_IN on Bottom Layer: 8.77,4.85 2.16,4.85 2.16,0.66 15.49,0.66 15.49,6.5 10.42,6.5
BATT_IN on Inner1: 8.77,4.85 2.16,4.85 2.16,0.66 15.49,0.66 15.49,6.5 10.42,6.5
BATT_IN on Inner2: 8.77,4.85 2.16,4.85 2.16,0.66 15.49,0.66 15.49,7.13 11.06,7.13
V_IN on Top Layer: 38.66,24.86 39.72,25.93 45.87,25.93 45.87,0.66 38.66,0.66
V_IN on Top Layer: 17.15,7.13 26.92,7.13 26.92,0.53 17.15,0.53
V_IN on Bottom Layer: 26.92,1.29 17.15,1.29 17.15,9.55 19.18,9.55 19.81,8.91 21.59,8.91 21.59,7.42 21.84,7.17 26.92,7.17
V_IN on Bottom Layer: 39.42,25.88 45.99,25.88 45.99,0.53 39.42,0.53
V_IN on Inner1: 17.15,7.13 26.92,7.13 26.92,0.53 17.15,0.53
V_IN on Inner1: 22.73,3.62 28,7.64 32.99,7.64 35.28,14.22 37.19,14.22 38.5,15.5 38.51,24.86 39.57,25.93 45.72,25.93 45.72,0.15 22.73,0.15
V_IN on Inner1: 22.73,3.62 28,7.64 32.99,7.64 35.28,14.22 37.19,14.22 38.5,15.5 38.51,24.86 39.57,25.93 45.72,25.93 45.72,0.15 22.73,0.15
V_IN on Inner2: 22.73,4.77 28.16,8.91 33.35,8.91 35.28,14.22 38.22,14.22 38.49,14.49 38.51,24.86 39.57,25.93 45.72,25.93 45.72,0.15 22.73,0.15
V_IN on Inner2: 17.15,7.13 26.92,7.13 26.92,0.53 17.15,0.53
$5N11099 on Bottom Layer: 19.89,13.61 20.63,14.35 24.12,14.35 24.12,10.04 24,9.93 23.37,9.93 23.37,10.81 22.86,11.32 22.86,11.58 21.59,11.58 21.59,10.05 21,10.05 21,11.63 19.89,11.63

Small or netless copper shapes (teardrops, artwork), in the pictures only: 2 on Bottom Layer

## Text on the board
Bottom Silkscreen Layer: 3.8V - 30V DC Input / 50 Amp Capacity / 3.5 Amp Per Brushed Motor / 5VDC - 2 Amp Output | ESP32-C3 Robo Controller / v3.0
Top Silkscreen Layer: G 5V S | MOTOR SIG | 30V MAX | G 5V | SWITCH | VOUT | - BATT + | +-
